# Altium project PROJET ELECTRO.PrjPcb
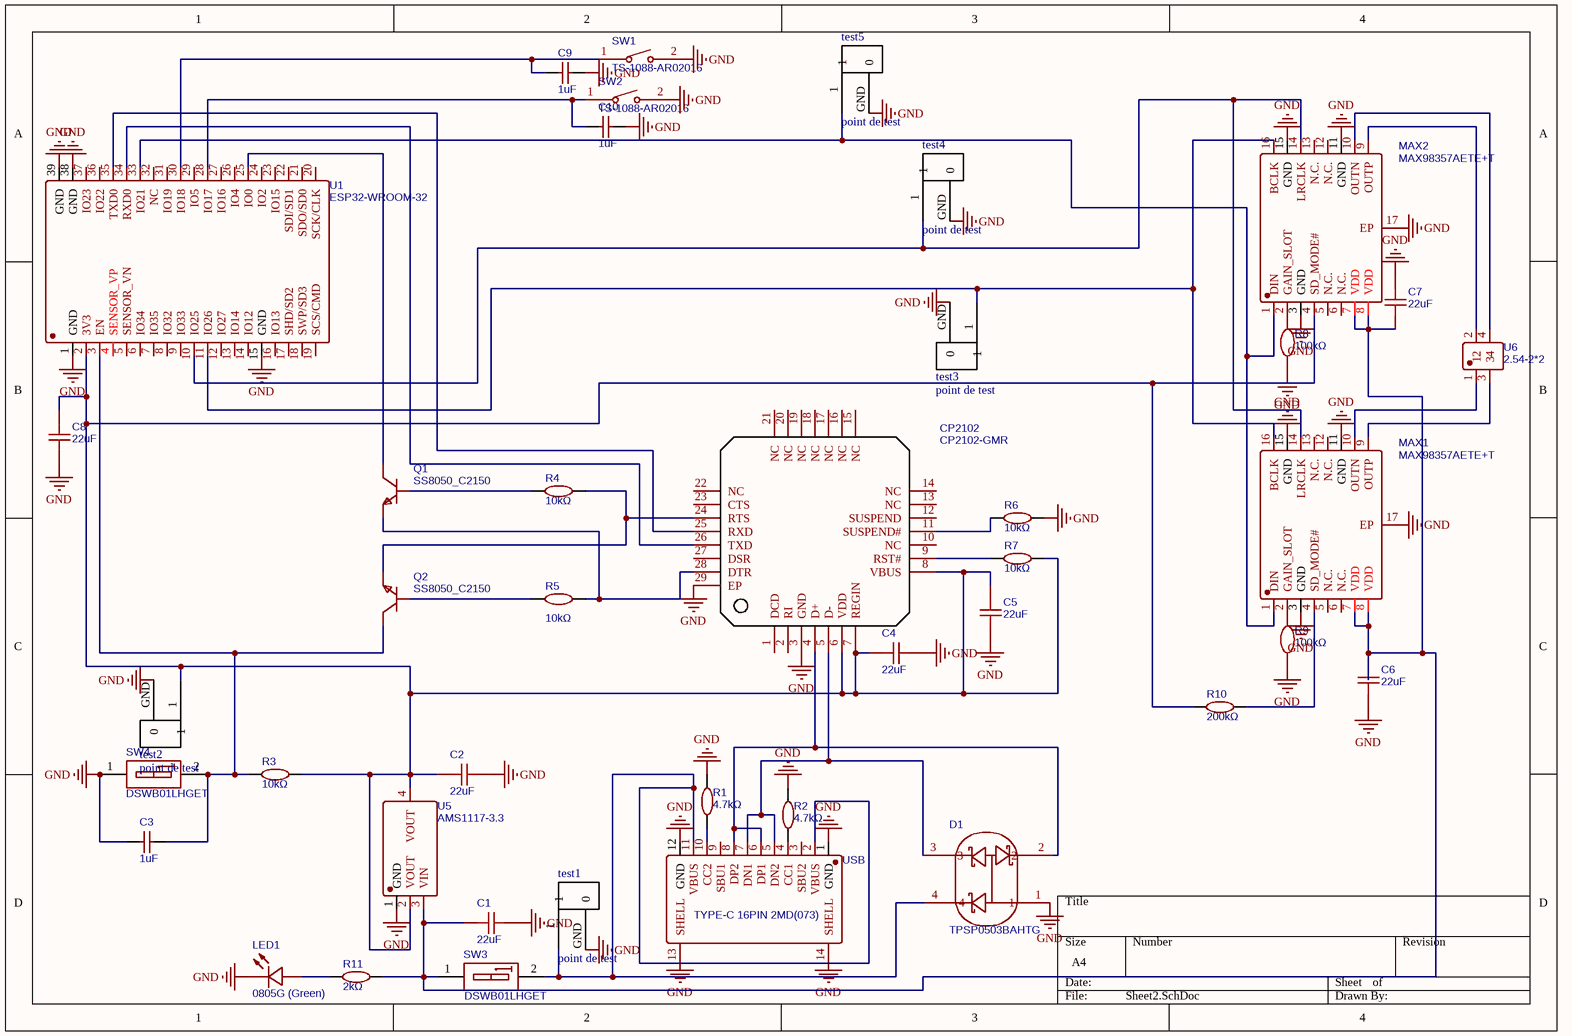
[diagram p0: Sheet2.SchDoc]
1 sheet, 41 parts. Net scope: global (net labels, ports and power ports of the same name join across sheets).
Board files: PCB2.PcbDoc, PCB3.PcbDoc

## Sheet Sheet2.SchDoc
size A4; SheetNumber: 1; SheetTotal: 1

### Parts
C1  22uF  [C0805]
C2  22uF  [C0805]
C3  1uF  [C0805]
C4  22uF  [C0805]
C5  22uF  [C0805]
C6  22uF  [C0805]
C7  22uF  [C0805]
C8  22uF  [C0805]
C9  1uF  [C0805]
C10  1uF  [C0805]
CP2102  CP2102-GMR  [WQFN-28_L5.0-W5.0-P0.50-BL-EP3.2]
D1  TPSP0503BAHTG  [SOT-143-4_L2.9-W1.3-P1.92-LS2.4-BL]
LED1  0805G (Green)  [LED0805-R-RD]
MAX1  MAX98357AETE+T  [TQFN-16_L3.0-W3.0-P0.50-BL-EP1.5]
MAX2  MAX98357AETE+T  [TQFN-16_L3.0-W3.0-P0.50-BL-EP1.5]
Q1  SS8050_C2150  [SOT-23-3_L2.9-W1.3-P1.90-LS2.4-BR]
Q2  SS8050_C2150  [SOT-23-3_L2.9-W1.3-P1.90-LS2.4-BR]
R1  4.7kΩ  [R0805]
R2  4.7kΩ  [R0805]
R3  10kΩ  [R0805]
R4  10kΩ  [R0805]
R5  10kΩ  [R0805]
R6  10kΩ  [R0805]
R7  10kΩ  [R0805]
R8  100kΩ  [R0805]
R9  100kΩ  [R0805]
R10  200kΩ  [R0805]
R11  2kΩ  [R0805]
SW1  TS-1088-AR02016  [SW-SMD_L3.9-W3.0-P4.45]
SW2  TS-1088-AR02016  [SW-SMD_L3.9-W3.0-P4.45]
SW3  DSWB01LHGET  [SW-TH_DSWB01LHGET]
SW4  DSWB01LHGET  [SW-TH_DSWB01LHGET]
test1  point de test  [point de test]
test2  point de test  [point de test]
test3  point de test  [point de test]
test4  point de test  [point de test]
test5  point de test  [point de test]
U1  ESP32-WROOM-32  [WIFIM-SMD_ESP32-WROOM-32-N4]
U5  AMS1117-3.3  [SOT-223-3_L6.5-W3.4-P2.30-LS7.0-BR]
U6  2.54-2*2  [HDR-TH_4P-P2.54-V-F-R2-C2-S2.54]
USB  TYPE-C 16PIN 2MD(073)  [USB-C-SMD_TYPE-C-6PIN-2MD-073]

### Nets
GND: C1.2 C2.2 C3.1 C4.2 C5.1 C6.1 C7.2 C8.2 C9.2 C10.2 CP2102.3(GND) CP2102.29(EP) D1.1 LED1.2(K) MAX1.3(GND) MAX1.11(GND) MAX1.15(GND) MAX1.17(EP) MAX2.3(GND) MAX2.11(GND) MAX2.15(GND) MAX2.17(EP) R1.2 R2.2 R6.2 R8.1 R9.1 SW1.2 SW2.2 SW4.1(A1) test1.GND(0) test2.GND(0) test3.GND(0) test4.GND(0) test5.GND(0) U1.1(GND) U1.15(GND) U1.38(GND) U1.39(GND) U5.1(GND) USB.1(GND) USB.12(GND) USB.13(SHELL) USB.14(SHELL)
NetC1_1: C1.1 C6.2 C7.1 MAX1.7(VDD) MAX1.8(VDD) MAX2.7(VDD) MAX2.8(VDD) R11.2 SW3.1(A1) U5.3(VIN)
NetC2_1: C2.1 C4.1 C5.2 C8.1 CP2102.6(VDD) CP2102.7(REGIN) CP2102.8(VBUS) MAX2.4(SD_MODE#) R3.2 R7.2 R10.1 test2.1 U1.2(3V3) U5.2(VOUT) U5.4(VOUT)
NetC3_2: C3.2 Q2.3(C) R3.1 SW4.2 U1.3(EN)
NetC9_1: C9.1 SW1.1 U1.30(IO18)
NetC10_1: C10.1 SW2.1 U1.28(IO17)
NetCP2102_4: CP2102.4(D+) D1.2 USB.6(DP1) USB.8(DP2)
NetCP2102_5: CP2102.5(D-) D1.3 USB.5(DN2) USB.7(DN1)
NetCP2102_9: CP2102.9(RST#) R7.1
NetCP2102_11: CP2102.11(SUSPEND#) R6.1
NetCP2102_24: CP2102.24(RTS) Q2.2(E) R4.2
NetCP2102_25: CP2102.25(RXD) U1.35(TXD0)
NetCP2102_26: CP2102.26(TXD) U1.34(RXD0)
NetCP2102_28: CP2102.28(DTR) Q1.2(E) R5.2
NetD1_4: D1.4 SW3.2 test1.1 USB.2(VBUS) USB.11(VBUS)
NetLED1_1: LED1.1(A) R11.1
NetMAX1_1: MAX1.1(DIN) MAX2.1(DIN) test5.1 U1.33(IO21)
NetMAX1_2: MAX1.2(GAIN_SLOT) R9.2
NetMAX1_4: MAX1.4(SD_MODE#) R10.2
NetMAX1_9: MAX1.9(OUTP) U6.3
NetMAX1_10: MAX1.10(OUTN) U6.1
NetMAX1_14: MAX1.14(LRCLK) MAX2.14(LRCLK) test4.1 U1.10(IO25)
NetMAX1_16: MAX1.16(BCLK) MAX2.16(BCLK) test3.1 U1.11(IO26)
NetMAX2_2: MAX2.2(GAIN_SLOT) R8.2
NetMAX2_9: MAX2.9(OUTP) U6.2
NetMAX2_10: MAX2.10(OUTN) U6.4
NetQ1_1: Q1.1(B) R4.1
NetQ1_3: Q1.3(C) U1.25(IO0)
NetQ2_1: Q2.1(B) R5.1
NetR1_1: R1.1 USB.10(CC2)
NetR2_1: R2.1 USB.4(CC1)

Not connected (* = marked no-connect by the designer): CP2102 1(DCD) 2(RI) 10(NC) 12(SUSPEND) 13(NC) 14(NC) 15(NC) 16(NC) 17(NC) 18(NC) 19(NC) 20(NC) 21(NC) 22(NC) 23(CTS) 27(DSR); MAX1 5(N.C.) 6(N.C.) 12(N.C.) 13(N.C.); MAX2 5(N.C.) 6(N.C.) 12(N.C.) 13(N.C.); U1 4(SENSOR_VP) 5(SENSOR_VN) 6(IO34) 7(IO35) 8(IO32) 9(IO33) 12(IO27) 13(IO14) 14(IO12) 16(IO13) 17(SHD/SD2) 18(SWP/SD3) 19(SCS/CMD) 20(SCK/CLK) 21(SDO/SD0) 22(SDI/SD1) 23(IO15) 24(IO2) 26(IO4) 27(IO16) 29(IO5) 31(IO19) 32(NC) 36(IO22) 37(IO23); USB 3(SBU2) 9(SBU1)

### Library data of the parts
C1 C2 C4-C8 = 22uF: Manufacturer: SAMSUNG(三星); Manufacturer Part: CL21A226MAQNNNE; nameAlias: Value; Supplier: LCSC; Supplier Part: C45783; JLCPCB Part Class: Basic Part; spicePre: C; spiceSymbolName: CL21A226MAQNNNE
C3 C9 C10 = 1uF: Manufacturer Part: CL21B105KBFNNNE; Manufacturer: SAMSUNG(三星); nameAlias: Value; Supplier: LCSC; Supplier Part: C28323; JLCPCB Part Class: Basic Part; spicePre: C; spiceSymbolName: CL21B105KBFNNNE
CP2102 = CP2102-GMR: Manufacturer: SKYWORKS/SILICON LABS(芯科); Supplier: LCSC; Manufacturer Part: CP2102-GMR; Supplier Part: C6568; JLCPCB Part Class: Extended Part; spicePre: U; spiceSymbolName: CP2102-GMR
D1 = TPSP0503BAHTG: Manufacturer: TECH PUBLIC(台舟); Contributor: LCSC; Supplier: LCSC; Supplier Part: C2682275; Manufacturer Part: TPSP0503BAHTG; JLCPCB Part Class: Extended Part; spicePre: D; spiceSymbolName: TPSP0503BAHTG
LED1 = 0805G (Green): Manufacturer: KENTO; Manufacturer Part: KT-0805翠绿; Supplier: LCSC; Supplier Part: C2297; JLCPCB Part Class: Basic Part; spicePre: L; spiceSymbolName: 0805G (Green)
MAX1 MAX2 = MAX98357AETE+T: Manufacturer: ADI(亚德诺)/MAXIM(美信); Contributor: LCSC; Supplier: LCSC; Supplier Part: C910544; Manufacturer Part: MAX98357AETE+T; JLCPCB Part Class: Extended Part; spicePre: U; spiceSymbolName: MAX98357AETE+T
Q1 Q2 = SS8050_C2150: Manufacturer: CJ(江苏长电/长晶); Manufacturer Part: SS8050; Supplier: LCSC; Supplier Part: C2150; JLCPCB Part Class: Basic Part; spicePre: Q; spiceSymbolName: SS8050_C2150
R1 R2 = 4.7kΩ: Manufacturer: UNI-ROYAL(厚声); Manufacturer Part: 0805W8F4701T5E; nameAlias: Value; Supplier: LCSC; Supplier Part: C17673; JLCPCB Part Class: Basic Part; spicePre: R; spiceSymbolName: 0805W8F4701T5E
R3-R7 = 10kΩ: Manufacturer: UNI-ROYAL(厚声); Manufacturer Part: 0805W8F1002T5E; nameAlias: Value; Supplier: LCSC; Supplier Part: C17414; JLCPCB Part Class: Basic Part; spicePre: R; spiceSymbolName: 0805W8F1002T5E
R8 R9 = 100kΩ: Manufacturer: FOJAN(富捷); Manufacturer Part: FRC0805J104 TS; nameAlias: Value; Contributor: lcsc; Supplier: LCSC; Supplier Part: C2907293; JLCPCB Part Class: Extended Part; spicePre: R; spiceSymbolName: FRC0805J104 TS
R10 = 200kΩ: Manufacturer: UNI-ROYAL(厚声); Manufacturer Part: 0805W8F2003T5E; nameAlias: Value; Supplier: LCSC; Supplier Part: C17539; JLCPCB Part Class: Basic Part; spicePre: R; spiceSymbolName: 0805W8F2003T5E
R11 = 2kΩ: Manufacturer: UNI-ROYAL(厚声); Manufacturer Part: 0805W8F2001T5E; nameAlias: Value; Supplier: LCSC; Supplier Part: C17604; JLCPCB Part Class: Basic Part; spicePre: R; spiceSymbolName: 0805W8F2001T5E
SW1 SW2 = TS-1088-AR02016: Manufacturer: XUNPU(讯普); Contributor: LCSC; Supplier: LCSC; Supplier Part: C720477; Manufacturer Part: TS-1088-AR02016; JLCPCB Part Class: Extended Part; spicePre: S; spiceSymbolName: TS-1088-AR02016
SW3 SW4 = DSWB01LHGET: Manufacturer: YE; Supplier: LCSC; Manufacturer Part: DSWB01LHGET; Supplier Part: C126888; JLCPCB Part Class: Extended Part; spicePre: S; spiceSymbolName: DSWB01LHGET
U1 = ESP32-WROOM-32: Manufacturer: ESPRESSIF(乐鑫); Manufacturer Part: ESP32-WROOM-32-N4; Contributor: LCSC; Supplier: LCSC; Supplier Part: C82899; JLCPCB Part Class: Extended Part; spicePre: U; spiceSymbolName: ESP32-WROOM-32
U5 = AMS1117-3.3: Manufacturer: AMS; sourceId: dwIGgezVh; timeStamp: 1476261164; Supplier: LCSC; Manufacturer Part: AMS1117-3.3; Supplier Part: C6186; JLCPCB Part Class: Basic Part; spicePre: U; spiceSymbolName: AMS1117-3.3
U6 = 2.54-2*2: Manufacturer: ZHOURI(洲日); Contributor: LCSC; Supplier: LCSC; Supplier Part: C2977590; Manufacturer Part: 2.54-2*2; JLCPCB Part Class: Extended Part; spicePre: U; spiceSymbolName: 2.54-2*2
USB = TYPE-C 16PIN 2MD(073): Manufacturer: SHOU HAN(首韩); Contributor: LCSC; Supplier: LCSC; Supplier Part: C2765186; Manufacturer Part: TYPE-C 16PIN 2MD(073); JLCPCB Part Class: Extended Part; spicePre: U; spiceSymbolName: TYPE-C 16PIN 2MD(073)